# EAGLE schematic Base Board (EAGLE 7.1.0)
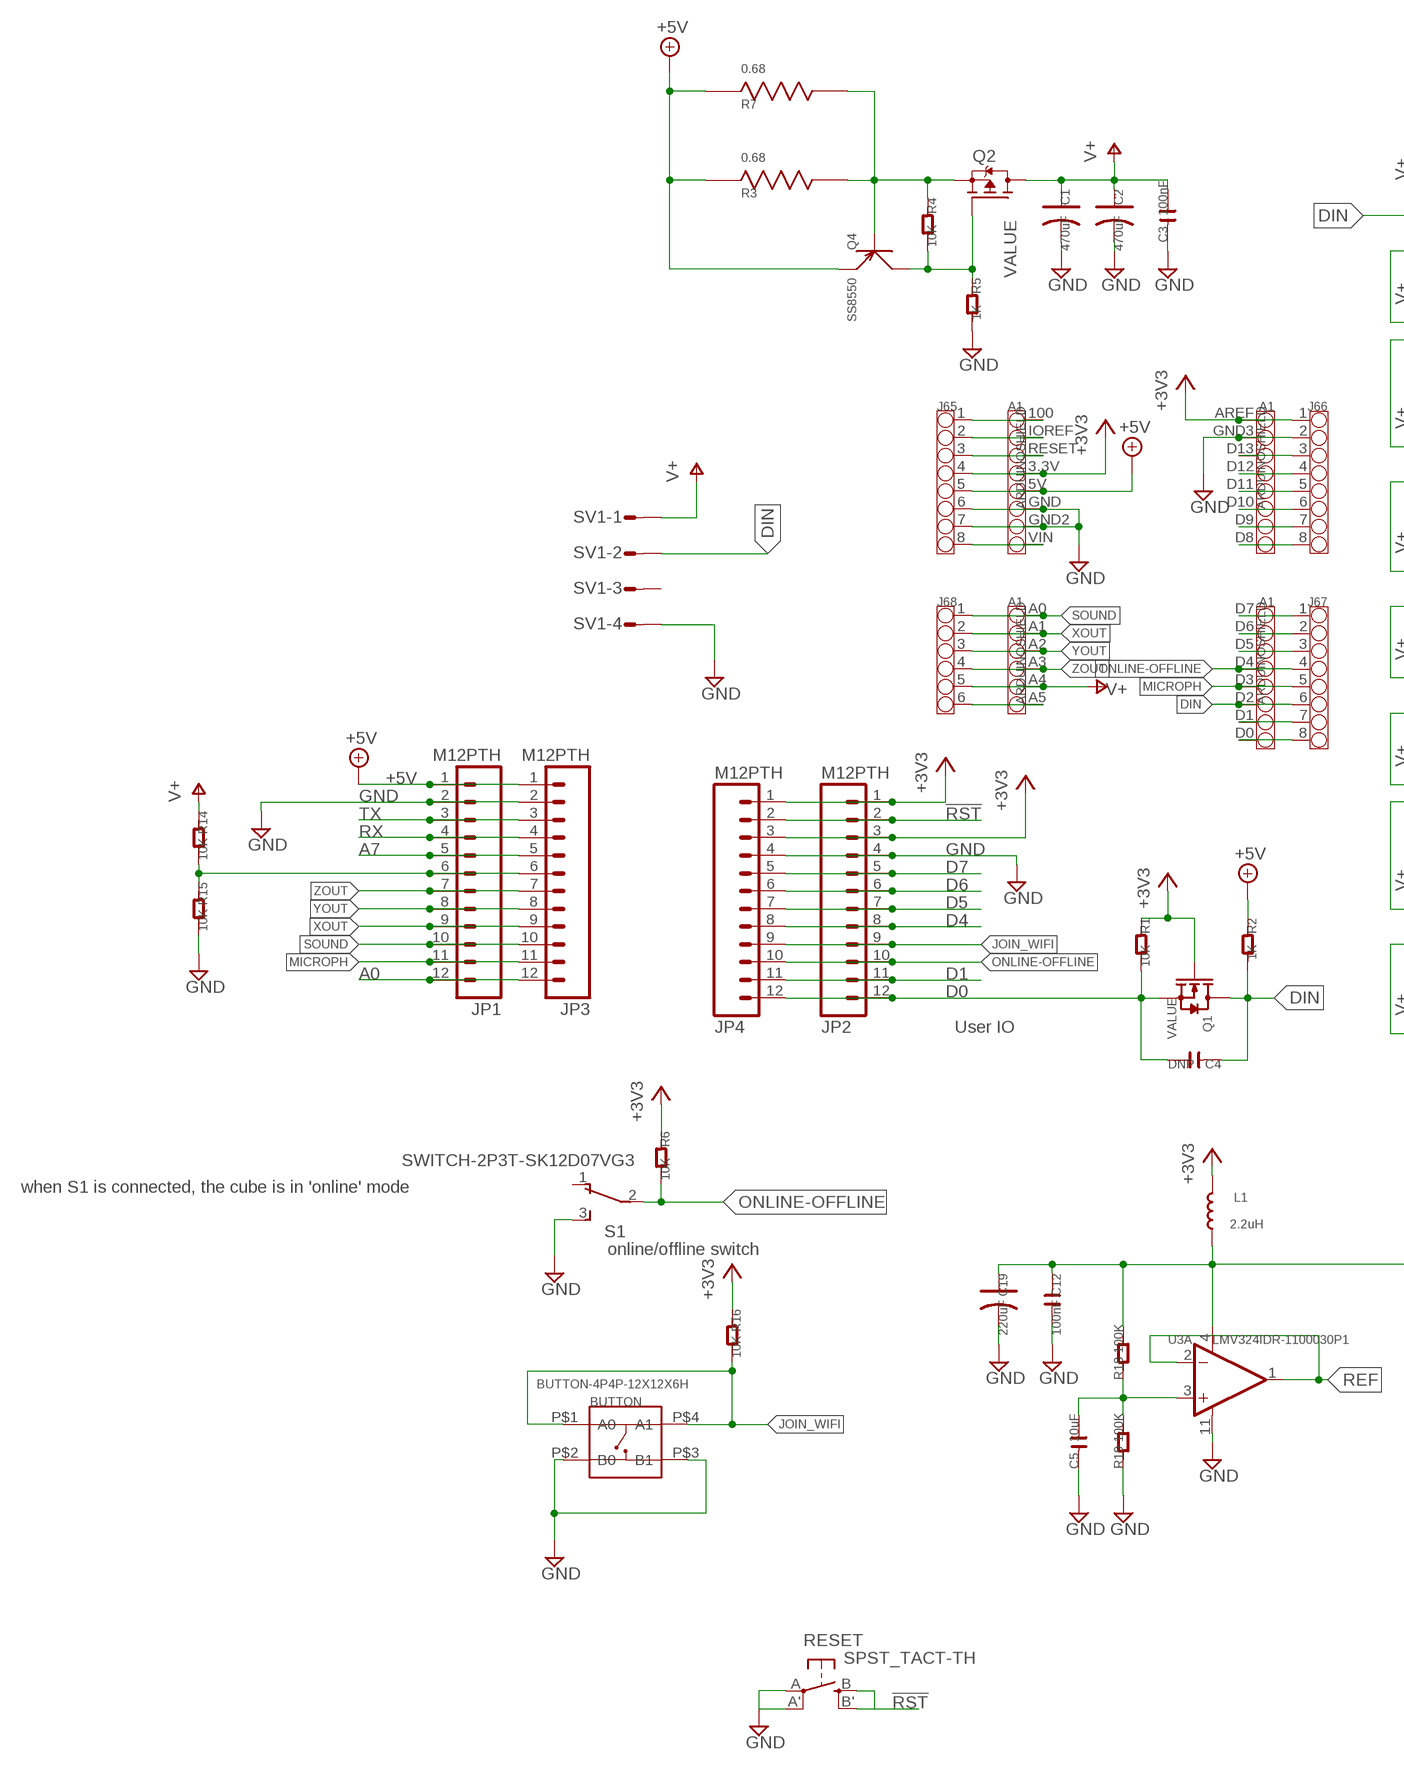
[diagram p0: schematic, sheet 1, part 1 of 2]
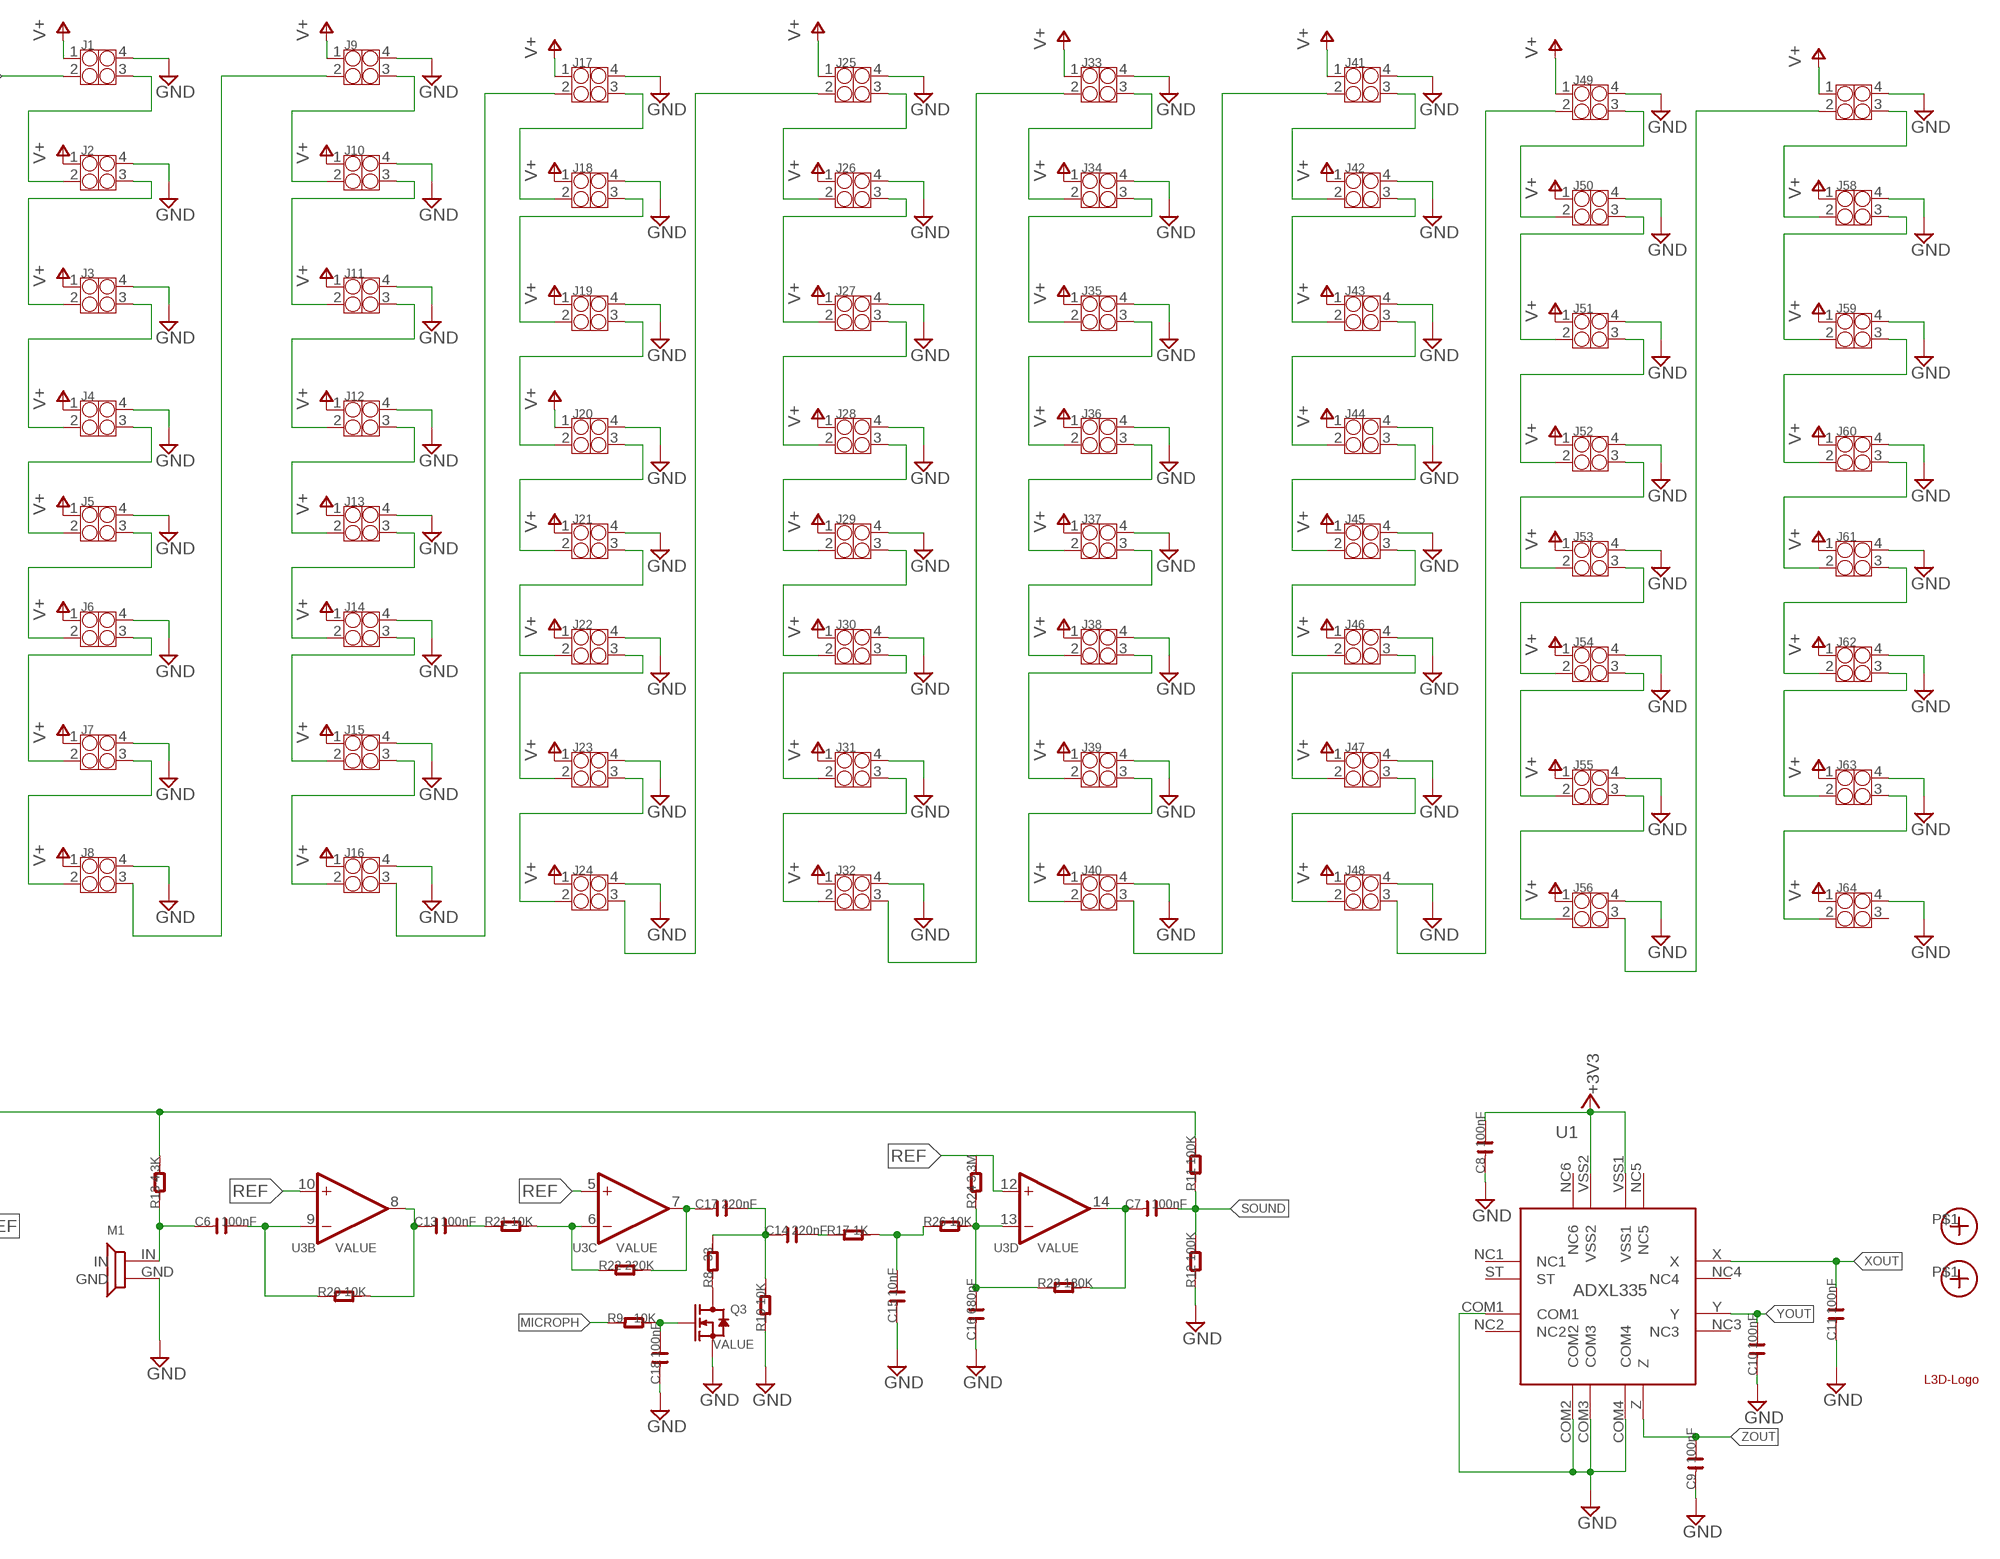
[diagram p1: schematic, sheet 1, part 2 of 2]

## Parts
A1  ARDUINOSHIELD  [ARDUINOSHIELD]
BUTTON  BUTTON-4P4P-12X12X6H  [4P-12X12X6H]
C1  470uF  C-POLAR  [CAPACITOR-E3-8]
C2  470uF  C-POLAR  [CAPACITOR-E3-8]
C3  100nF  C-0603  [C0603]
C4  DNP  C-0603  [C0603]
C5  10uF  C-0603  [C0603]
C6  100nF  C-0603  [C0603]
C7  100nF  C-0603  [C0603]
C8  100nF  C-0603  [C0603]
C9  100nF  C-0603  [C0603]
C10  100nF  C-0603  [C0603]
C11  100nF  C-0603  [C0603]
C12  100nF  C-0603  [C0603]
C13  100nF  C-0603  [C0603]
C14  220nF  C-0603  [C0603]
C15  10nF  C-0603  [C0603]
C16  680pF  C-0603  [C0603]
C17  220nF  C-0603  [C0603]
C18  100nF  C-0603  [C0603]
C19  220uF  C-POLAR-B  [AVX-B]
J1  CONNECTOR-HEADER-2X2P2X2P-2.54-REVERSE  [2X2P-2.54-REVERSE]
J2  CONNECTOR-HEADER-2X2P2X2P-2.54-REVERSE  [2X2P-2.54-REVERSE]
J3  CONNECTOR-HEADER-2X2P2X2P-2.54-REVERSE  [2X2P-2.54-REVERSE]
J4  CONNECTOR-HEADER-2X2P2X2P-2.54-REVERSE  [2X2P-2.54-REVERSE]
J5  CONNECTOR-HEADER-2X2P2X2P-2.54-REVERSE  [2X2P-2.54-REVERSE]
J6  CONNECTOR-HEADER-2X2P2X2P-2.54-REVERSE  [2X2P-2.54-REVERSE]
J7  CONNECTOR-HEADER-2X2P2X2P-2.54-REVERSE  [2X2P-2.54-REVERSE]
J8  CONNECTOR-HEADER-2X2P2X2P-2.54-REVERSE  [2X2P-2.54-REVERSE]
J9  CONNECTOR-HEADER-2X2P2X2P-2.54-REVERSE  [2X2P-2.54-REVERSE]
J10  CONNECTOR-HEADER-2X2P2X2P-2.54-REVERSE  [2X2P-2.54-REVERSE]
J11  CONNECTOR-HEADER-2X2P2X2P-2.54-REVERSE  [2X2P-2.54-REVERSE]
J12  CONNECTOR-HEADER-2X2P2X2P-2.54-REVERSE  [2X2P-2.54-REVERSE]
J13  CONNECTOR-HEADER-2X2P2X2P-2.54-REVERSE  [2X2P-2.54-REVERSE]
J14  CONNECTOR-HEADER-2X2P2X2P-2.54-REVERSE  [2X2P-2.54-REVERSE]
J15  CONNECTOR-HEADER-2X2P2X2P-2.54-REVERSE  [2X2P-2.54-REVERSE]
J16  CONNECTOR-HEADER-2X2P2X2P-2.54-REVERSE  [2X2P-2.54-REVERSE]
J17  CONNECTOR-HEADER-2X2P2X2P-2.54-REVERSE  [2X2P-2.54-REVERSE]
J18  CONNECTOR-HEADER-2X2P2X2P-2.54-REVERSE  [2X2P-2.54-REVERSE]
J19  CONNECTOR-HEADER-2X2P2X2P-2.54-REVERSE  [2X2P-2.54-REVERSE]
J20  CONNECTOR-HEADER-2X2P2X2P-2.54-REVERSE  [2X2P-2.54-REVERSE]
J21  CONNECTOR-HEADER-2X2P2X2P-2.54-REVERSE  [2X2P-2.54-REVERSE]
J22  CONNECTOR-HEADER-2X2P2X2P-2.54-REVERSE  [2X2P-2.54-REVERSE]
J23  CONNECTOR-HEADER-2X2P2X2P-2.54-REVERSE  [2X2P-2.54-REVERSE]
J24  CONNECTOR-HEADER-2X2P2X2P-2.54-REVERSE  [2X2P-2.54-REVERSE]
J25  CONNECTOR-HEADER-2X2P2X2P-2.54-REVERSE  [2X2P-2.54-REVERSE]
J26  CONNECTOR-HEADER-2X2P2X2P-2.54-REVERSE  [2X2P-2.54-REVERSE]
J27  CONNECTOR-HEADER-2X2P2X2P-2.54-REVERSE  [2X2P-2.54-REVERSE]
J28  CONNECTOR-HEADER-2X2P2X2P-2.54-REVERSE  [2X2P-2.54-REVERSE]
J29  CONNECTOR-HEADER-2X2P2X2P-2.54-REVERSE  [2X2P-2.54-REVERSE]
J30  CONNECTOR-HEADER-2X2P2X2P-2.54-REVERSE  [2X2P-2.54-REVERSE]
J31  CONNECTOR-HEADER-2X2P2X2P-2.54-REVERSE  [2X2P-2.54-REVERSE]
J32  CONNECTOR-HEADER-2X2P2X2P-2.54-REVERSE  [2X2P-2.54-REVERSE]
J33  CONNECTOR-HEADER-2X2P2X2P-2.54-REVERSE  [2X2P-2.54-REVERSE]
J34  CONNECTOR-HEADER-2X2P2X2P-2.54-REVERSE  [2X2P-2.54-REVERSE]
J35  CONNECTOR-HEADER-2X2P2X2P-2.54-REVERSE  [2X2P-2.54-REVERSE]
J36  CONNECTOR-HEADER-2X2P2X2P-2.54-REVERSE  [2X2P-2.54-REVERSE]
J37  CONNECTOR-HEADER-2X2P2X2P-2.54-REVERSE  [2X2P-2.54-REVERSE]
J38  CONNECTOR-HEADER-2X2P2X2P-2.54-REVERSE  [2X2P-2.54-REVERSE]
J39  CONNECTOR-HEADER-2X2P2X2P-2.54-REVERSE  [2X2P-2.54-REVERSE]
J40  CONNECTOR-HEADER-2X2P2X2P-2.54-REVERSE  [2X2P-2.54-REVERSE]
J41  CONNECTOR-HEADER-2X2P2X2P-2.54-REVERSE  [2X2P-2.54-REVERSE]
J42  CONNECTOR-HEADER-2X2P2X2P-2.54-REVERSE  [2X2P-2.54-REVERSE]
J43  CONNECTOR-HEADER-2X2P2X2P-2.54-REVERSE  [2X2P-2.54-REVERSE]
J44  CONNECTOR-HEADER-2X2P2X2P-2.54-REVERSE  [2X2P-2.54-REVERSE]
J45  CONNECTOR-HEADER-2X2P2X2P-2.54-REVERSE  [2X2P-2.54-REVERSE]
J46  CONNECTOR-HEADER-2X2P2X2P-2.54-REVERSE  [2X2P-2.54-REVERSE]
J47  CONNECTOR-HEADER-2X2P2X2P-2.54-REVERSE  [2X2P-2.54-REVERSE]
J48  CONNECTOR-HEADER-2X2P2X2P-2.54-REVERSE  [2X2P-2.54-REVERSE]
J49  CONNECTOR-HEADER-2X2P2X2P-2.54-REVERSE  [2X2P-2.54-REVERSE]
J50  CONNECTOR-HEADER-2X2P2X2P-2.54-REVERSE  [2X2P-2.54-REVERSE]
J51  CONNECTOR-HEADER-2X2P2X2P-2.54-REVERSE  [2X2P-2.54-REVERSE]
J52  CONNECTOR-HEADER-2X2P2X2P-2.54-REVERSE  [2X2P-2.54-REVERSE]
J53  CONNECTOR-HEADER-2X2P2X2P-2.54-REVERSE  [2X2P-2.54-REVERSE]
J54  CONNECTOR-HEADER-2X2P2X2P-2.54-REVERSE  [2X2P-2.54-REVERSE]
J55  CONNECTOR-HEADER-2X2P2X2P-2.54-REVERSE  [2X2P-2.54-REVERSE]
J56  CONNECTOR-HEADER-2X2P2X2P-2.54-REVERSE  [2X2P-2.54-REVERSE]
J57  CONNECTOR-HEADER-2X2P2X2P-2.54-REVERSE  [2X2P-2.54-REVERSE]
J58  CONNECTOR-HEADER-2X2P2X2P-2.54-REVERSE  [2X2P-2.54-REVERSE]
J59  CONNECTOR-HEADER-2X2P2X2P-2.54-REVERSE  [2X2P-2.54-REVERSE]
J60  CONNECTOR-HEADER-2X2P2X2P-2.54-REVERSE  [2X2P-2.54-REVERSE]
J61  CONNECTOR-HEADER-2X2P2X2P-2.54-REVERSE  [2X2P-2.54-REVERSE]
J62  CONNECTOR-HEADER-2X2P2X2P-2.54-REVERSE  [2X2P-2.54-REVERSE]
J63  CONNECTOR-HEADER-2X2P2X2P-2.54-REVERSE  [2X2P-2.54-REVERSE]
J64  CONNECTOR-HEADER-2X2P2X2P-2.54-REVERSE  [2X2P-2.54-REVERSE]
J65  CONNECTOR-HEADER-8P-3460290P1  [1X8P-2.54-8.5-BLACK-FEMALE]
J66  CONNECTOR-HEADER-8P-3460290P1  [1X8P-2.54-8.5-BLACK-FEMALE]
J67  CONNECTOR-HEADER-8P-3460290P1  [1X8P-2.54-8.5-BLACK-FEMALE]
J68  CONNECTOR-HEADER-6P-3460270P1  [1X6P-2.54-8.5-BLACK-FEMALE]
JP1  M12PTH  [1X12-SMALL-PADS]
JP2  M12PTH  [1X12-SMALL-PADS]
JP3  M12PTH  [1X12-SMALL-PADS]
JP4  M12PTH  [1X12-SMALL-PADS]
L1  2.2uH  L-0603  [L0603]
M1  MICROPHONE  [MICROPHONE]
Q1  2N7002  MOSFET-N-044020001  [SOT23]
Q2  FDD6637  FDD4141TO252  [TO252]
Q3  2N7002  MOSFET-N-044020001  [SOT23]
Q4  SS8550  TRANSISTOR-PNP-041003001  [SOT23]
R1  10K  R-0603  [R0603]
R2  1K  R-0603  [R0603]
R3  0.68  RESISTOR-3W-20MM  [RESISTOR-3W-20MM]
R4  10K  R-0603  [R0603]
R5  1K  R-0603  [R0603]
R6  10K  R-0603  [R0603]
R7  0.68  RESISTOR-3W-20MM  [RESISTOR-3W-20MM]
R8  33  R-0603  [R0603]
R9  10K  R-0603  [R0603]
R10  10K  R-0603  [R0603]
R11  100K  R-0603  [R0603]
R12  100K  R-0603  [R0603]
R13  4.3K  R-0603  [R0603]
R14  10K  R-0603  [R0603]
R15  10K  R-0603  [R0603]
R16  10K  R-0603  [R0603]
R17  1K  R-0603  [R0603]
R18  100K  R-0603  [R0603]
R19  100K  R-0603  [R0603]
R20  10K  R-0603  [R0603]
R21  10K  R-0603  [R0603]
R22  220K  R-0603  [R0603]
R23  180K  R-0603  [R0603]
R24  3.3M  R-0603  [R0603]
R26  10K  R-0603  [R0603]
RESET  SPST_TACT-TH  [EVQ-Q2-TH]
S1  SWITCH-2P3T-SK12D07VG3  [SWITCH-2P3T-SK12D07VG3]
SV1  CON-S04P  [S04P]
U1  ADXL335  [ADXL335]
U3  LMV324IDR-1100030P1  [SOIC14]
U$1  L3D-LOGOL3DCUBE-LOGO-0.8X2.5  [L3DCUBE-LOGO-0.8X2.5]
U$2  FIDUCIAL-MARK  [FIDUCIAL-MARK]
U$3  FIDUCIAL-MARK  [FIDUCIAL-MARK]

## Nets
!RST: JP2.2 JP4.2 RESET.B'(S1) RESET.B(S)
+3V3: A1.3.3V A1.AREF C8.2 J65.4 J66.1 JP2.1 JP2.3 JP4.1 JP4.3 L1.2 Q1.1(G) R1.1 R6.1 R16.1 U1.VSS1 U1.VSS2
+5V: A1.5V J65.5 JP1.1 JP3.1 Q4.2(E) R2.1 R3.1 R7.1
A0: JP1.12 JP3.12
A7: JP1.5 JP3.5
D0: C4.2 JP2.12 JP4.12 Q1.2(S) R1.2
D1: JP2.11 JP4.11
D4: JP2.8 JP4.8
D5: JP2.7 JP4.7
D6: JP2.6 JP4.6
D7: JP2.5 JP4.5
DIN: A1.D2 C4.1 J1.2 J67.6 Q1.3(D) R2.2 SV1.2 SV1.P$2
GND [vcc]: A1.GND A1.GND2 A1.GND3 BUTTON.P$2(B0) BUTTON.P$3(B1) C1.- C2.- C3.1 C5.1 C8.1 C9.1 C10.1 C11.1 C12.2 C15.1 C16.1 C18.1 C19.- J1.4 J2.4 J3.4 J4.4 J5.4 J6.4 J7.4 J8.4 J9.4 J10.4 J11.4 J12.4 J13.4 J14.4 J15.4 J16.4 J17.4 J18.4 J19.4 J20.4 J21.4 J22.4 J23.4 J24.4 J25.4 J26.4 J27.4 J28.4 J29.4 J30.4 J31.4 J32.4 J33.4 J34.4 J35.4 J36.4 J37.4 J38.4 J39.4 J40.4 J41.4 J42.4 J43.4 J44.4 J45.4 J46.4 J47.4 J48.4 J49.4 J50.4 J51.4 J52.4 J53.4 J54.4 J55.4 J56.4 J57.4 J58.4 J59.4 J60.4 J61.4 J62.4 J63.4 J64.4 J65.6 J65.7 J66.2 JP1.2 JP2.4 JP3.2 JP4.4 M1.GND Q3.2(S) R5.2 R10.1 R12.1 R15.2 R19.1 RESET.A'(P1) RESET.A(P) S1.3(S) SV1.4 SV1.P$4 U1.COM1 U1.COM2 U1.COM3 U1.COM4 U3.11(A:V-)
JOIN_WIFI: BUTTON.P$1(A0) BUTTON.P$4(A1) JP2.9 JP4.9 R16.2
MICROPH: A1.D3 J67.5 JP1.11 JP3.11 R9.1
N$1: J1.3 J2.2
N$2: J2.3 J3.2
N$3: J3.3 J4.2
N$4: J5.3 J6.2
N$5: J6.3 J7.2
N$6: J7.3 J8.2
N$7: J4.3 J5.2
N$8: J9.3 J10.2
N$9: J10.3 J11.2
N$10: J11.3 J12.2
N$11: J13.3 J14.2
N$12: J14.3 J15.2
N$13: J15.3 J16.2
N$14: J12.3 J13.2
N$15: J17.3 J18.2
N$16: J18.3 J19.2
N$17: J19.3 J20.2
N$18: J21.3 J22.2
N$19: J22.3 J23.2
N$20: J23.3 J24.2
N$21: J20.3 J21.2
N$22: J25.3 J26.2
N$23: J26.3 J27.2
N$24: J27.3 J28.2
N$25: J29.3 J30.2
N$26: J30.3 J31.2
N$27: J31.3 J32.2
N$28: J28.3 J29.2
N$29: J8.3 J9.2
N$30: J16.3 J17.2
N$31: J24.3 J25.2
N$32: C18.2 Q3.1(G) R9.2
N$33: J33.3 J34.2
N$34: J34.3 J35.2
N$35: J35.3 J36.2
N$36: J37.3 J38.2
N$37: J38.3 J39.2
N$38: J39.3 J40.2
N$39: J36.3 J37.2
N$40: J41.3 J42.2
N$41: J42.3 J43.2
N$42: J43.3 J44.2
N$43: J45.3 J46.2
N$44: J46.3 J47.2
N$45: J47.3 J48.2
N$46: J44.3 J45.2
N$47: J49.3 J50.2
N$48: J50.3 J51.2
N$49: J51.3 J52.2
N$50: J53.3 J54.2
N$51: J54.3 J55.2
N$52: J55.3 J56.2
N$53: J52.3 J53.2
N$54: J57.3 J58.2
N$55: J58.3 J59.2
N$56: J59.3 J60.2
N$57: J61.3 J62.2
N$58: J62.3 J63.2
N$59: J63.3 J64.2
N$60: J60.3 J61.2
N$61: J40.3 J41.2
N$62: J48.3 J49.2
N$63: J56.3 J57.2
N$64: J32.3 J33.2
N$65: Q2.2(S) Q4.1(B) R3.2 R4.1 R7.2
N$66: Q3.3(D) R8.1
N$67: Q2.1(G) Q4.3(C) R4.2 R5.1
N$68: C14.2 R17.1
N$69: C15.2 R17.2 R26.1
N$70: C16.2 R23.1 R24.1 R26.2 U3.13(D:IN-)
N$71: JP1.6 JP3.6 R14.2 R15.1
N$72: C6.1 M1.IN R13.1
N$73: A1.100 J65.1
N$74: A1.IOREF J65.2
N$82: A1.RESET J65.3
N$83: A1.VIN J65.8
N$84: A1.A5 J68.6
N$85: A1.D13 J66.3
N$86: A1.D12 J66.4
N$87: A1.D11 J66.5
N$88: A1.D10 J66.6
N$89: A1.D9 J66.7
N$90: A1.D8 J66.8
N$91: A1.D7 J67.1
N$92: A1.D6 J67.2
N$93: A1.D5 J67.3
N$94: A1.D1 J67.7
N$95: A1.D0 J67.8
N$96: C5.2 R18.1 R19.2 U3.3(A:IN+)
N$97: C6.2 R20.1 U3.9(B:IN-)
N$98: C13.1 R20.2 U3.8(B:OUT)
N$99: C13.2 R21.1
N$100: R21.2 R22.1 U3.6(C:IN-)
N$101: C14.1 C17.2 R8.2 R10.2
N$102: C12.1 C19.+ L1.1 R11.2 R13.2 R18.2 U3.4(A:V+)
N$104: C7.1 R23.2 U3.14(D:OUT)
N$106: C17.1 R22.2 U3.7(C:OUT)
ONLINE-OFFLINE: A1.D4 J67.4 JP2.10 JP4.10 R6.2 S1.2(P)
REF: R24.2 U3.1(A:OUT) U3.2(A:IN-) U3.5(C:IN+) U3.10(B:IN+) U3.12(D:IN+)
RX: JP1.4 JP3.4
SOUND: A1.A0 C7.2 J68.1 JP1.10 JP3.10 R11.1 R12.2
TX: JP1.3 JP3.3
V+: A1.A4 C1.+ C2.+ C3.2 J1.1 J2.1 J3.1 J4.1 J5.1 J6.1 J7.1 J8.1 J9.1 J10.1 J11.1 J12.1 J13.1 J14.1 J15.1 J16.1 J17.1 J18.1 J19.1 J20.1 J21.1 J22.1 J23.1 J24.1 J25.1 J26.1 J27.1 J28.1 J29.1 J30.1 J31.1 J32.1 J33.1 J34.1 J35.1 J36.1 J37.1 J38.1 J39.1 J40.1 J41.1 J42.1 J43.1 J44.1 J45.1 J46.1 J47.1 J48.1 J49.1 J50.1 J51.1 J52.1 J53.1 J54.1 J55.1 J56.1 J57.1 J58.1 J59.1 J60.1 J61.1 J62.1 J63.1 J64.1 J68.5 Q2.3(D) R14.1 SV1.1 SV1.P$1
XOUT: A1.A1 C11.2 J68.2 JP1.9 JP3.9 U1.X
YOUT: A1.A2 C10.2 J68.3 JP1.8 JP3.8 U1.Y
ZOUT: A1.A3 C9.2 J68.4 JP1.7 JP3.7 U1.Z
Unconnected: J64.3 S1.1(O) SV1.3 SV1.P$3 U1.NC1 U1.NC2 U1.NC3 U1.NC4 U1.NC5 U1.NC6 U1.ST U$2.P$1 U$3.P$1

## Notes on the sheet
- User IO
- when S1 is connected, the cube is in 'online' mode
- online/offline switch

## Library data of the parts
A1 = OPL Eagle Library:ARDUINOSHIELD
BUTTON = OPL Eagle Library:BUTTON-4P
C1 C2 C19 = OPL Eagle Library:C-POLAR*
C3-C18 = OPL Eagle Library:C*
J1-J64 = OPL Eagle Library:CONNECTOR-HEADER-2X2P
J65-J67 = OPL Eagle Library:CONNECTOR-HEADER-8P
J68 = OPL Eagle Library:CONNECTOR-HEADER-6P
JP1-JP4 = Spark:M12: Header 12 Standard 12-pin 0.1" header. Use with straight break away headers (SKU : PRT-00116), right angle break away headers (PRT-00553), swiss pins (PRT-00743), machine pins (PRT-00117), and female headers (PRT-00115).
L1 = OPL Eagle Library:L*
M1 = OPL Eagle Library:MICROPHONE
Q1 Q3 = OPL Eagle Library:MOSFET-N: CJ2302：SMD MOSFET N-CH 20V-2.1A
Q2 = transistor-fet:FDD4141: P-Channel PowerTrench® MOSFET Source: FDD4141.pdf
Q4 = OPL Eagle Library:TRANSISTOR-PNP*: S8550：PNP Transistor
R1 R2 R4-R6 R8-R24 R26 = OPL Eagle Library:R*
R3 R7 = OPL Eagle Library:RESISTOR-3W-20MM
RESET = adafruit:SPST_TACT: SMT 6mm switch, EVQQ2 series http://www.ladyada.net/library/eagle
S1 = OPL Eagle Library:SWITCH-2P3T-SK12D07VG3: TINY SWITCH ON - ON Source: http://www2.produktinfo.conrad.com/datenblaetter/700000-724999/705152-da-01-de-Subminiaturschalter_TL_36YO.pdf
SV1 = OPL Eagle Library:CON-S04P: AMP MT CONNECTOR; OC_FARNELL: unknown; OC_NEWARK: unknown
U1 = OPL Eagle Library:ADXL335
U3 = OPL Eagle Library:LMV324IDR: General purpose LOW Voltage, Rail-to-Rail Output Amplifiers http://www.fairchildsemi.com/ds/LM/LMV358.pdf
U$1 = OPL Eagle Library:L3D-LOGO
U$2 U$3 = OPL Eagle Library:FIDUCIAL-MARK